# Altium project Rotary_Encoder.PrjPcb
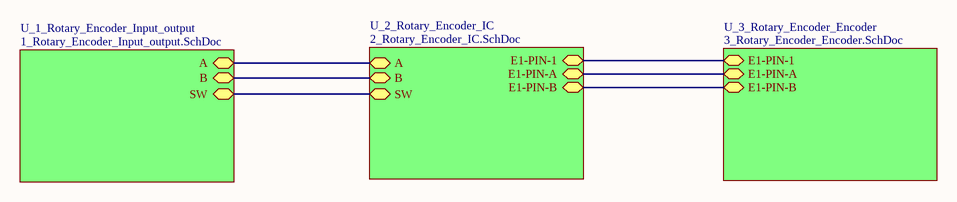
[diagram p0: 0_Rotary_Encoder_Overview.SchDoc]
4 sheets, 20 parts. Net scope: hierarchical (ports join the sheet entries above them; power ports are global).
Board files: Rotary_Encoder_Square_Edge.PcbDoc, Rotary_Encoder_Round_Edge.PcbDoc
Sheets:
  0_Rotary_Encoder_Overview.SchDoc
    U_1_Rotary_Encoder_Input_output = 1_Rotary_Encoder_Input_output.SchDoc
    U_3_Rotary_Encoder_Encoder = 3_Rotary_Encoder_Encoder.SchDoc
    U_2_Rotary_Encoder_IC = 2_Rotary_Encoder_IC.SchDoc

## Sheet 0_Rotary_Encoder_Overview.SchDoc
size A4; SheetNumber: 1; SheetTotal: 4

### Sub-sheets
U_1_Rotary_Encoder_Input_output = 1_Rotary_Encoder_Input_output.SchDoc: A (bidir), SW (bidir), B (bidir)
U_2_Rotary_Encoder_IC = 2_Rotary_Encoder_IC.SchDoc: A (bidir), B (bidir), SW (bidir), E1-PIN-1 (bidir), E1-PIN-B (bidir), E1-PIN-A (bidir)
U_3_Rotary_Encoder_Encoder = 3_Rotary_Encoder_Encoder.SchDoc: E1-PIN-1 (bidir), E1-PIN-A (bidir), E1-PIN-B (bidir)

### Nets
A: sheet U_1_Rotary_Encoder_Input_output/A, sheet U_2_Rotary_Encoder_IC/A
B: sheet U_1_Rotary_Encoder_Input_output/B, sheet U_2_Rotary_Encoder_IC/B
E1-PIN-1: sheet U_3_Rotary_Encoder_Encoder/E1-PIN-1, sheet U_2_Rotary_Encoder_IC/E1-PIN-1
E1-PIN-A: sheet U_3_Rotary_Encoder_Encoder/E1-PIN-A, sheet U_2_Rotary_Encoder_IC/E1-PIN-A
E1-PIN-B: sheet U_3_Rotary_Encoder_Encoder/E1-PIN-B, sheet U_2_Rotary_Encoder_IC/E1-PIN-B
SW: sheet U_1_Rotary_Encoder_Input_output/SW, sheet U_2_Rotary_Encoder_IC/SW

## Sheet 1_Rotary_Encoder_Input_output.SchDoc
size A4; SheetNumber: 2; SheetTotal: 4
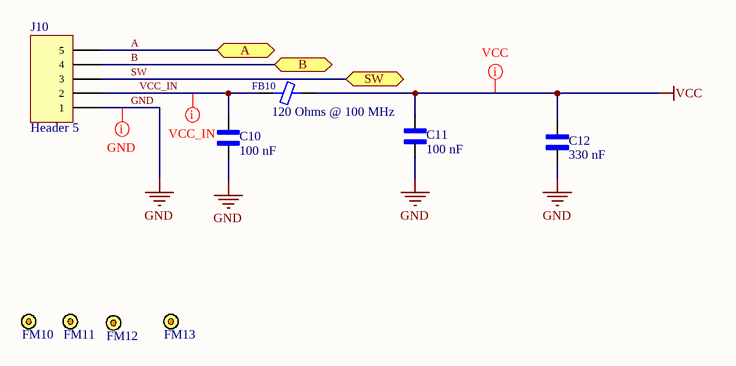
[diagram p1: 1_Rotary_Encoder_Input_output.SchDoc]

### Parts
C10  100 nF  [C-0603]
C11  100 nF  [C-0603]
C12  330 nF  [C-0603]
FB10  120 Ohms @ 100 MHz  [FER 0603_1608]
FM10  FM  [Fiducial_Marker_1mm]  (value not drawn)
FM11  FM  [Fiducial_Marker_1mm]  (value not drawn)
FM12  FM  [Fiducial_Marker_1mm]  (value not drawn)
FM13  FM  [Fiducial_Marker_1mm]  (value not drawn)
J10  Header 5  [HDR1X5]

### Ports
A (bidir), B (bidir), SW (bidir)

### Nets
GND: C10.1 C11.1 C12.1 J10.1
VCC: C11.2 C12.2 FB10.2
A: J10.5 ; port A
B: J10.4 ; port B
SW: J10.3 ; port SW
VCC_IN: C10.2 FB10.1 J10.2

### Layout directives
net class Power: VCC, VCC_IN
net class GND: GND

### Library data of the parts
C10-C12 = C-0603: Ceramic Capacitor 16V 0603 (1608 Metric); MP: C0603C104J4RAC; MF: KEMET; SnapEDA_Link: https://www.snapeda.com/parts/C0603C104J4RAC/KEMET/view-part/1763758/?ref=snap; Availability: Warning; Package: 0603 KEMET; Check_prices: https://www.snapeda.com/parts/C0603C104J4RAC/KEMET/view-part/1763758/?ref=eda; Value: *; Price: None
FB10 = PE-0603PFB121ST: FERRITE BEAD 120 OHM 0603 1LN; Manufacturer: Pulse Electronics Network; Current Rating (Max): 2A; DC Resistance (DCR) (Max): 50mOhm; Filter Type: Power Line; Number of Lines: 1; XjtagCategorisation: Ferrite Bead.pdd; Part Number: PE-0603PFB121ST; ComponentLink1Description: Datasheet; ComponentLink1URL: https://productfinder.pulseeng.com/doc_type/WEB301/doc_num/WC706/doc_part/WC706.pdf; ComponentLink2Description: DigiKey Link; ComponentLink2URL: https://www.digikey.com/en/products/detail/pulse-electronics-network/PE-0603PFB121ST/5050544; Device Package: 0603 (1608 Metric); Height (Max): 0.041" (1.05mm); Impedance @ Frequency: 120 Ohms @ 100 MHz; LastUpdated: 19-09-2022 13:44:01; Lifecycle Status: Active; Minimum Order: 1; Mounting Type: Surface Mount; Operating Temperature: -40°C ~ 105°C; Package / Case: 0603 (1608 Metric); Packaging: TapeAndReel; PartId: 591; Part Status: Active; Price: 0.01; Series: PFB; Size / Dimension: 0.063" L x 0.032" W (1.60mm x 0.80mm); Supplier 1: DigiKey; Supplier Part Number 1: 553-2387-6-ND; Value: 120 Ohms @ 100 MHz
FM10-FM13 = Fiducial Marker
J10 = Header 5: Header, 5-Pin; LatestRevisionDate: 17-Jul-2002; LatestRevisionNote: Re-released for DXP Platform.; Publisher: Altium Limited

## Sheet 3_Rotary_Encoder_Encoder.SchDoc
size A4; SheetNumber: 4; SheetTotal: 4
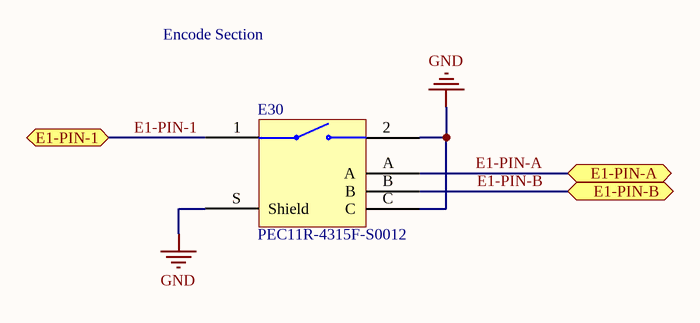
[diagram p2: 3_Rotary_Encoder_Encoder.SchDoc]

### Parts
E30  PEC11R-4315F-S0012  [BOURNS PEC11R-4315F-S0012]

### Ports
E1-PIN-1 (bidir), E1-PIN-A (bidir), E1-PIN-B (bidir)

### Nets
GND: E30.2 E30.C E30.S(Shield)
E1-PIN-1: E30.1 ; port E1-PIN-1
E1-PIN-A: E30.A ; port E1-PIN-A
E1-PIN-B: E30.B ; port E1-PIN-B

### Notes on the sheet
- Encode Section

### Library data of the parts
E30 = PEC11R-4315F-S0012: ROTARY ENCODER MECHANICAL 12PPR; Manufacturer 1: Bourns; Manufacturer: Bourns Inc.; Output Type: Quadrature (Incremental); Built in Switch: Yes; Number of Channels: 2; Pulses per Revolution: 12; Capacitance: 4315F; Actuator Type: 6mm Dia Flatted End; Rotational Life (Cycles Min): 30K; Supplier 1: DigiKey; Manufacturer Part Number 1: PEC11R-4315F-S0012; Stock 1: 453; Pricing 1: 1=1.91000, 10=1.68200, 25=1.50800, 50=1.45000, 100=1.39200, 250=1.33400, 500=1.10200, 1000=1.04400, 5000=0.87000 (USD); RoHS: Yes; Mount: Through Hole,Panel,PCB; Min Operating Temperature: -30°C; Max Operating Temperature: 70°C; Termination: PC Pin; Packaging: Unknown; Package Quantity: 75; Encoder Type: Mechanical; Detent: Yes; Orientation: Vertical; Length: 21.5mm; Height: 13.4mm; Width: 12.5mm; ComponentLink1URL: https://www.bourns.com/docs/Product-Datasheets/PEC11R.pdf; ComponentLink1Description: Datasheet; ComponentLink2URL: http://digikey.com/product-detail/en/bourns-inc/PEC11R-4315F-S0012/PEC11R-4315F-S0012-ND/4699232; ComponentLink2Description: DigiKey Link; Part Number: PEC11R-4315F-S0012; LastUpdated: 25-06-2020 15:43:12; Lifecycle Status: Active; Minimum Order: 1; Mounting Type: Panel, PCB Through Hole; Part Status: Active; Price: 1.91; Series: PEC11R; Supplier Part Number 1: PEC11R-4315F-S0012-ND; Termination Style: PC Pin

## Sheet 2_Rotary_Encoder_IC.SchDoc
size A4; SheetNumber: 3; SheetTotal: 4
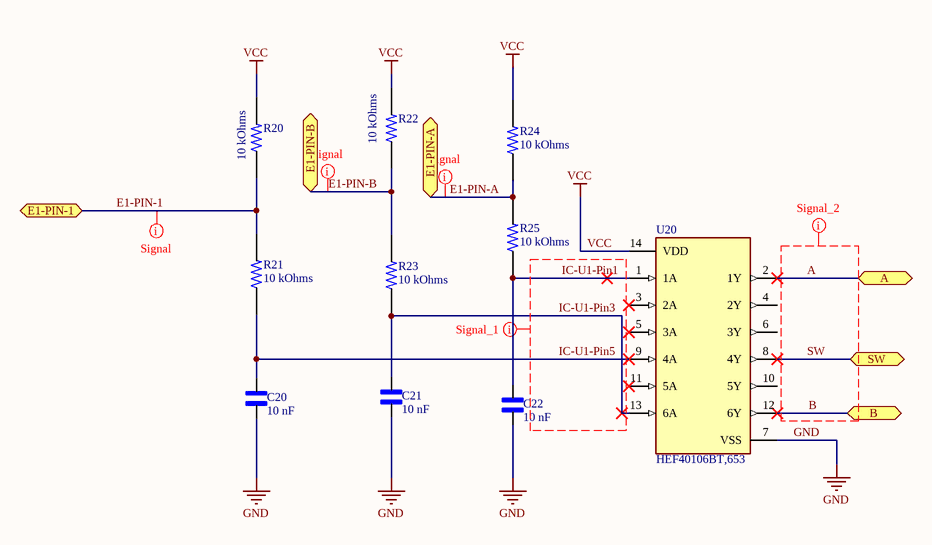
[diagram p3: 2_Rotary_Encoder_IC.SchDoc]

### Parts
C20  10 nF  [C-0603]
C21  10 nF  [C-0603]
C22  10 nF  [C-0603]
R20  10 kOhms  [R-0603]
R21  10 kOhms  [R-0603]
R22  10 kOhms  [R-0603]
R23  10 kOhms  [R-0603]
R24  10 kOhms  [R-0603]
R25  10 kOhms  [R-0603]
U20  HEF40106BT,653  [FP-SOT108-1-IPC_A]

### Ports
A (bidir), B (bidir), E1-PIN-1 (bidir), E1-PIN-A (bidir), E1-PIN-B (bidir), SW (bidir)

### Nets
GND: C20.1 C21.1 C22.1 U20.7(VSS)
VCC: R20.2 R22.2 R24.2 U20.14(VDD)
A: U20.2(1Y) ; port A
B: U20.12(6Y) ; port B
E1-PIN-1: R20.1 R21.2 ; port E1-PIN-1
E1-PIN-A: R24.1 R25.2 ; port E1-PIN-A
E1-PIN-B: R22.1 R23.2 ; port E1-PIN-B
IC-U1-Pin1: C22.2 R25.1 U20.1(1A)
IC-U1-Pin3: C21.2 R23.1 U20.13(6A)
IC-U1-Pin5: C20.2 R21.1 U20.9(4A)
SW: U20.8(4Y) ; port SW

Not connected (* = marked no-connect by the designer): U20 3(2A)* 4(2Y) 5(3A)* 6(3Y) 10(5Y) 11(5A)*

### Layout directives
net class Signal: A, B, E1-PIN-1, E1-PIN-A, E1-PIN-B, IC-U1-Pin1, IC-U1-Pin3, IC-U1-Pin5, SW

### Library data of the parts
C20-C22 = C-0603: as C10 on sheet 1_Rotary_Encoder_Input_output; SnapEDA_Link: https://www.snapeda.com/parts/C0603C104J4RAC/KEMET/view-part/1763758/?ref=snap; Availability: Warning; Package: 0603 KEMET; Check_prices: https://www.snapeda.com/parts/C0603C104J4RAC/KEMET/view-part/1763758/?ref=eda; Value: *; Price: None
R20 R22 R24 = R-0603: 0603; MP: 2-1623703-0; Power_Rating: .1 W; Value: 10K; Tolerance: 1%; MF: TE Connectivity; XjtagCategorisation: pull-resistor.pdd; Package: 0603; Price: None; Resistance: 10K; Check_prices: https://www.snapeda.com/parts/2-1623703-0/TE%20Connectivity/view-part/2213192/?ref=eda; SnapEDA_Link: https://www.snapeda.com/parts/2-1623703-0/TE%20Connectivity/view-part/2213192/?ref=snap; Availability: Warning
R21 R23 R25 = R-0603: 0603; MP: 2-1623703-0; Power_Rating: .1 W; Value: 10K; Tolerance: 1%; MF: TE Connectivity; XjtagCategorisation: resistor.pdd; Package: 0603; Price: None; Resistance: 10K; Check_prices: https://www.snapeda.com/parts/2-1623703-0/TE%20Connectivity/view-part/2213192/?ref=eda; SnapEDA_Link: https://www.snapeda.com/parts/2-1623703-0/TE%20Connectivity/view-part/2213192/?ref=snap; Availability: Warning
U20 = CD4016B: IC INVERT SCHMITT 6CH 6-INP 14SO; RoHS Compliant: Yes

## Nets that join several sheets
GND: 1_Rotary_Encoder_Input_output (C10.1 C11.1 C12.1 J10.1), 3_Rotary_Encoder_Encoder (E30.2 E30.C E30.S), 2_Rotary_Encoder_IC (C20.1 C21.1 C22.1 U20.7)
VCC: 1_Rotary_Encoder_Input_output (C11.2 C12.2 FB10.2), 2_Rotary_Encoder_IC (R20.2 R22.2 R24.2 U20.14)
A: 1_Rotary_Encoder_Input_output (J10.5), 2_Rotary_Encoder_IC (U20.2)
B: 1_Rotary_Encoder_Input_output (J10.4), 2_Rotary_Encoder_IC (U20.12)
E1-PIN-1: 3_Rotary_Encoder_Encoder (E30.1), 2_Rotary_Encoder_IC (R20.1 R21.2)
E1-PIN-A: 3_Rotary_Encoder_Encoder (E30.A), 2_Rotary_Encoder_IC (R24.1 R25.2)
E1-PIN-B: 3_Rotary_Encoder_Encoder (E30.B), 2_Rotary_Encoder_IC (R22.1 R23.2)
SW: 1_Rotary_Encoder_Input_output (J10.3), 2_Rotary_Encoder_IC (U20.8)